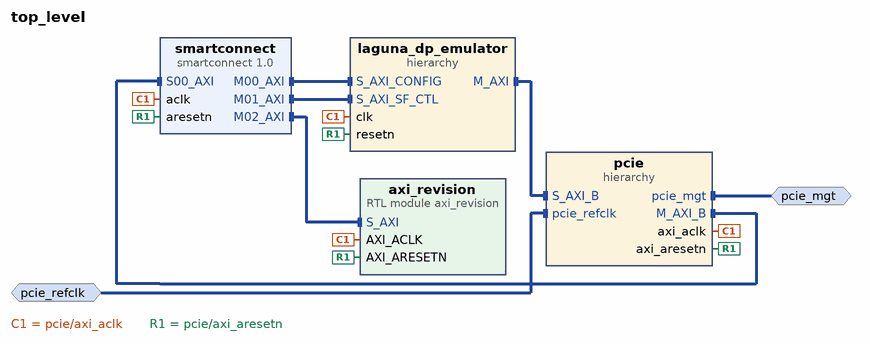
[diagram p0: block diagram of the top level]
# Vivado block design top_level, xcvu3p-ffvc1517-2-e, Vivado 2021.1
create_bd_design top_level

create_bd_intf_port -mode Slave -vlnv xilinx.com:interface:diff_clock_rtl:1.0 pcie_refclk
create_bd_intf_port -mode Master -vlnv xilinx.com:interface:pcie_7x_mgt_rtl:1.0 pcie_mgt

create_bd_cell -type hier pcie
create_bd_cell -type hier laguna_dp_emulator
create_bd_cell -type ip -vlnv xilinx.com:ip:smartconnect:1.0 smartconnect
set_property -dict {CONFIG.NUM_CLKS 1 CONFIG.NUM_MI 3 CONFIG.NUM_SI 1} [get_bd_cells smartconnect]
create_bd_cell -type module -reference axi_revision axi_revision

# ---- hierarchy /pcie ----
current_bd_instance /pcie
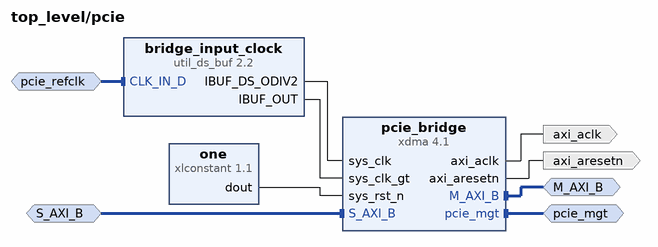
[diagram p1: block diagram inside /pcie]
create_bd_intf_pin -mode Master -vlnv xilinx.com:interface:aximm_rtl:1.0 M_AXI_B
create_bd_intf_pin -mode Slave -vlnv xilinx.com:interface:diff_clock_rtl:1.0 pcie_refclk
create_bd_intf_pin -mode Slave -vlnv xilinx.com:interface:aximm_rtl:1.0 S_AXI_B
create_bd_intf_pin -mode Master -vlnv xilinx.com:interface:pcie_7x_mgt_rtl:1.0 pcie_mgt
create_bd_pin -dir O -type clk axi_aclk
create_bd_pin -dir O axi_aresetn

create_bd_cell -type ip -vlnv xilinx.com:ip:util_ds_buf:2.2 bridge_input_clock
set_property -dict {CONFIG.C_BUF_TYPE IBUFDSGTE} [get_bd_cells bridge_input_clock]
create_bd_cell -type ip -vlnv xilinx.com:ip:xlconstant:1.1 one
create_bd_cell -type ip -vlnv xilinx.com:ip:xdma:4.1 pcie_bridge
set_property -dict [list \
  CONFIG.PF0_DEVICE_ID_mqdma 903F \
  CONFIG.PF0_SRIOV_VF_DEVICE_ID A03F \
  CONFIG.PF2_DEVICE_ID_mqdma 923F \
  CONFIG.PF3_DEVICE_ID_mqdma 933F \
  CONFIG.axi_addr_width 64 \
  CONFIG.axi_data_width 512_bit \
  CONFIG.axisten_freq 250 \
  CONFIG.bridge_burst true \
  CONFIG.functional_mode AXI_Bridge \
  CONFIG.mode_selection Advanced \
  CONFIG.pf0_bar0_scale Megabytes \
  CONFIG.pf0_bar0_size 1 \
  CONFIG.pf0_bar1_enabled true \
  CONFIG.pf0_bar1_scale Megabytes \
  CONFIG.pf0_bar1_size 1 \
  CONFIG.pf0_device_id 903F \
  CONFIG.pl_link_cap_max_link_speed 8.0_GT/s \
  CONFIG.pl_link_cap_max_link_width X16 \
  CONFIG.plltype QPLL1 \
] [get_bd_cells pcie_bridge]

# ---- hierarchy /laguna_dp_emulator ----
current_bd_instance /laguna_dp_emulator
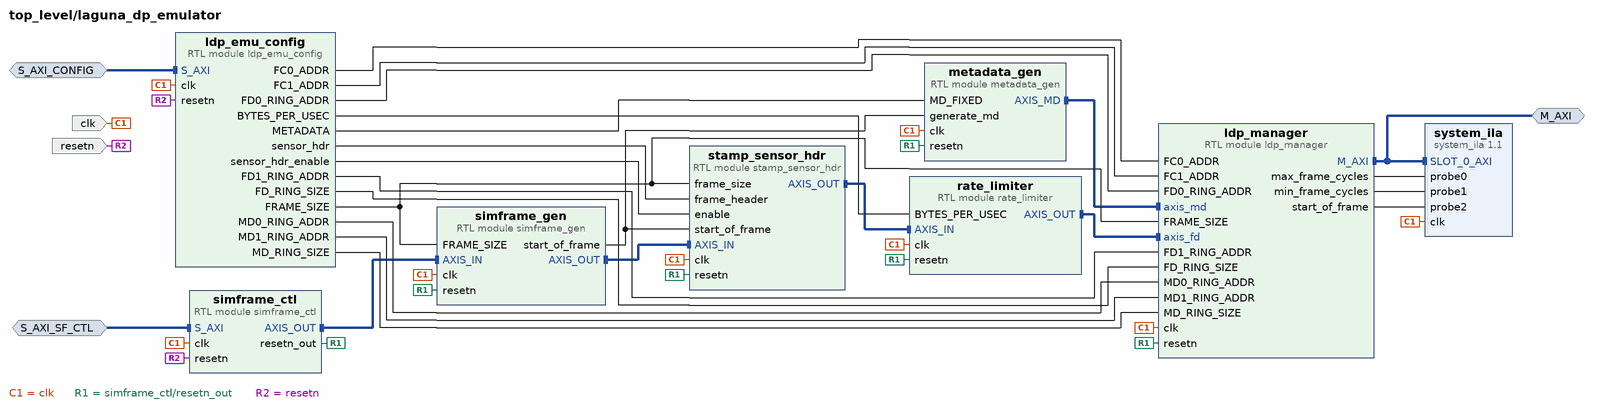
[diagram p2: block diagram inside /laguna_dp_emulator]
create_bd_intf_pin -mode Slave -vlnv xilinx.com:interface:aximm_rtl:1.0 S_AXI_CONFIG
create_bd_intf_pin -mode Slave -vlnv xilinx.com:interface:aximm_rtl:1.0 S_AXI_SF_CTL
create_bd_intf_pin -mode Master -vlnv xilinx.com:interface:aximm_rtl:1.0 M_AXI
create_bd_pin -dir I clk
create_bd_pin -dir I resetn

create_bd_cell -type module -reference metadata_gen metadata_gen
create_bd_cell -type module -reference rate_limiter rate_limiter
create_bd_cell -type module -reference simframe_gen simframe_gen
create_bd_cell -type module -reference simframe_ctl simframe_ctl
create_bd_cell -type module -reference stamp_sensor_hdr stamp_sensor_hdr
create_bd_cell -type ip -vlnv xilinx.com:ip:system_ila:1.1 system_ila
set_property -dict {CONFIG.C_DATA_DEPTH 2048 CONFIG.C_MON_TYPE MIX CONFIG.C_NUM_OF_PROBES 3} [get_bd_cells system_ila]
create_bd_cell -type module -reference ldp_emu_config ldp_emu_config
create_bd_cell -type module -reference ldp_manager ldp_manager

# ---- connections ----

current_bd_instance /pcie
connect_bd_intf_net [get_bd_intf_pins pcie_refclk] [get_bd_intf_pins bridge_input_clock/CLK_IN_D]
connect_bd_intf_net [get_bd_intf_pins pcie_mgt] [get_bd_intf_pins pcie_bridge/pcie_mgt]
connect_bd_intf_net [get_bd_intf_pins S_AXI_B] [get_bd_intf_pins pcie_bridge/S_AXI_B]
connect_bd_intf_net [get_bd_intf_pins M_AXI_B] [get_bd_intf_pins pcie_bridge/M_AXI_B]
connect_bd_net [get_bd_pins bridge_input_clock/IBUF_DS_ODIV2] [get_bd_pins pcie_bridge/sys_clk]
connect_bd_net [get_bd_pins bridge_input_clock/IBUF_OUT] [get_bd_pins pcie_bridge/sys_clk_gt]
connect_bd_net [get_bd_pins one/dout] [get_bd_pins pcie_bridge/sys_rst_n]
connect_bd_net [get_bd_pins pcie_bridge/axi_aclk] [get_bd_pins axi_aclk]
connect_bd_net [get_bd_pins pcie_bridge/axi_aresetn] [get_bd_pins axi_aresetn]

current_bd_instance /laguna_dp_emulator
connect_bd_intf_net -intf_net S_AXI_MC_CONFIG_1 [get_bd_intf_pins S_AXI_CONFIG] [get_bd_intf_pins ldp_emu_config/S_AXI]
connect_bd_intf_net [get_bd_intf_pins S_AXI_SF_CTL] [get_bd_intf_pins simframe_ctl/S_AXI]
connect_bd_intf_net [get_bd_intf_pins M_AXI] [get_bd_intf_pins ldp_manager/M_AXI]
connect_bd_intf_net [get_bd_intf_pins M_AXI] [get_bd_intf_pins system_ila/SLOT_0_AXI]
connect_bd_intf_net [get_bd_intf_pins ldp_manager/axis_md] [get_bd_intf_pins metadata_gen/AXIS_MD]
connect_bd_intf_net [get_bd_intf_pins ldp_manager/axis_fd] [get_bd_intf_pins rate_limiter/AXIS_OUT]
connect_bd_intf_net [get_bd_intf_pins simframe_ctl/AXIS_OUT] [get_bd_intf_pins simframe_gen/AXIS_IN]
connect_bd_intf_net [get_bd_intf_pins stamp_sensor_hdr/AXIS_IN] [get_bd_intf_pins simframe_gen/AXIS_OUT]
connect_bd_intf_net [get_bd_intf_pins stamp_sensor_hdr/AXIS_OUT] [get_bd_intf_pins rate_limiter/AXIS_IN]
connect_bd_net [get_bd_pins clk] \
  [get_bd_pins metadata_gen/clk] [get_bd_pins rate_limiter/clk] [get_bd_pins simframe_gen/clk] [get_bd_pins simframe_ctl/clk] \
  [get_bd_pins stamp_sensor_hdr/clk] [get_bd_pins system_ila/clk] [get_bd_pins ldp_emu_config/clk] \
  [get_bd_pins ldp_manager/clk]
connect_bd_net [get_bd_pins ldp_emu_config/BYTES_PER_USEC] [get_bd_pins rate_limiter/BYTES_PER_USEC]
connect_bd_net [get_bd_pins ldp_emu_config/FC0_ADDR] [get_bd_pins ldp_manager/FC0_ADDR]
connect_bd_net [get_bd_pins ldp_emu_config/FC1_ADDR] [get_bd_pins ldp_manager/FC1_ADDR]
connect_bd_net [get_bd_pins ldp_emu_config/FD0_RING_ADDR] [get_bd_pins ldp_manager/FD0_RING_ADDR]
connect_bd_net [get_bd_pins ldp_emu_config/FD1_RING_ADDR] [get_bd_pins ldp_manager/FD1_RING_ADDR]
connect_bd_net [get_bd_pins ldp_emu_config/FD_RING_SIZE] [get_bd_pins ldp_manager/FD_RING_SIZE]
connect_bd_net [get_bd_pins ldp_emu_config/FRAME_SIZE] \
  [get_bd_pins simframe_gen/FRAME_SIZE] [get_bd_pins stamp_sensor_hdr/frame_size] [get_bd_pins ldp_manager/FRAME_SIZE]
connect_bd_net [get_bd_pins ldp_emu_config/MD0_RING_ADDR] [get_bd_pins ldp_manager/MD0_RING_ADDR]
connect_bd_net [get_bd_pins ldp_emu_config/MD1_RING_ADDR] [get_bd_pins ldp_manager/MD1_RING_ADDR]
connect_bd_net [get_bd_pins ldp_emu_config/MD_RING_SIZE] [get_bd_pins ldp_manager/MD_RING_SIZE]
connect_bd_net [get_bd_pins ldp_emu_config/METADATA] [get_bd_pins metadata_gen/MD_FIXED]
connect_bd_net [get_bd_pins ldp_emu_config/sensor_hdr] [get_bd_pins stamp_sensor_hdr/frame_header]
connect_bd_net [get_bd_pins ldp_emu_config/sensor_hdr_enable] [get_bd_pins stamp_sensor_hdr/enable]
connect_bd_net [get_bd_pins ldp_manager/max_frame_cycles] [get_bd_pins system_ila/probe0]
connect_bd_net [get_bd_pins ldp_manager/min_frame_cycles] [get_bd_pins system_ila/probe1]
connect_bd_net [get_bd_pins ldp_manager/start_of_frame] [get_bd_pins system_ila/probe2]
connect_bd_net -net mindy_core_reset_external_resetn [get_bd_pins simframe_ctl/resetn_out] \
  [get_bd_pins metadata_gen/resetn] [get_bd_pins rate_limiter/resetn] [get_bd_pins simframe_gen/resetn] \
  [get_bd_pins stamp_sensor_hdr/resetn] [get_bd_pins ldp_manager/resetn]
connect_bd_net [get_bd_pins resetn] [get_bd_pins simframe_ctl/resetn] [get_bd_pins ldp_emu_config/resetn]
connect_bd_net [get_bd_pins simframe_gen/start_of_frame] [get_bd_pins metadata_gen/generate_md] [get_bd_pins stamp_sensor_hdr/start_of_frame]

current_bd_instance /
connect_bd_intf_net [get_bd_intf_pins laguna_dp_emulator/M_AXI] [get_bd_intf_pins pcie/S_AXI_B]
connect_bd_intf_net [get_bd_intf_ports pcie_refclk] [get_bd_intf_pins pcie/pcie_refclk]
connect_bd_intf_net [get_bd_intf_pins smartconnect/M00_AXI] [get_bd_intf_pins laguna_dp_emulator/S_AXI_CONFIG]
connect_bd_intf_net [get_bd_intf_pins smartconnect/M01_AXI] [get_bd_intf_pins laguna_dp_emulator/S_AXI_SF_CTL]
connect_bd_intf_net [get_bd_intf_pins axi_revision/S_AXI] [get_bd_intf_pins smartconnect/M02_AXI]
connect_bd_intf_net -intf_net xdma_0_M_AXI_B [get_bd_intf_pins pcie/M_AXI_B] [get_bd_intf_pins smartconnect/S00_AXI]
connect_bd_intf_net -intf_net xdma_0_pcie_mgt [get_bd_intf_ports pcie_mgt] [get_bd_intf_pins pcie/pcie_mgt]
connect_bd_net [get_bd_pins pcie/axi_aclk] [get_bd_pins smartconnect/aclk] [get_bd_pins laguna_dp_emulator/clk] [get_bd_pins axi_revision/AXI_ACLK]
connect_bd_net -net source_200Mhz_resetn [get_bd_pins pcie/axi_aresetn] \
  [get_bd_pins laguna_dp_emulator/resetn] [get_bd_pins smartconnect/aresetn] [get_bd_pins axi_revision/AXI_ARESETN]

# ---- address map ----
assign_bd_address -offset 0x0000000000000000 -range 16E -target_address_space [get_bd_addr_spaces laguna_dp_emulator/ldp_manager/M_AXI] [get_bd_addr_segs pcie/pcie_bridge/S_AXI_B/BAR0]
assign_bd_address -offset 0x0000000000000000 -range 256 -target_address_space [get_bd_addr_spaces pcie/pcie_bridge/M_AXI_B] [get_bd_addr_segs axi_revision/S_AXI/reg0]
assign_bd_address -offset 0x0000000000001000 -range 256 -target_address_space [get_bd_addr_spaces pcie/pcie_bridge/M_AXI_B] [get_bd_addr_segs laguna_dp_emulator/simframe_ctl/S_AXI/reg0]
assign_bd_address -offset 0x0000000000002000 -range 256 -target_address_space [get_bd_addr_spaces pcie/pcie_bridge/M_AXI_B] [get_bd_addr_segs laguna_dp_emulator/ldp_emu_config/S_AXI/reg0]

validate_bd_design
save_bd_design
